# Altium schematic sheet PD Controller Source.SchDoc
size 297 x 209 mm; CompanyName: Sainsbury Wellcome Centre; Organization: FabLab; Address1: Sainsbury Wellcome Centre; Address2: 25 Howland Street; Address3: London; Address4: W1T 4JG; DocumentNumber: 9; SheetNumber: 9; SheetTotal: 14; swcgroup: FabLab; Org: Sainsbury Wellcome Centre; Add1: 25 Howland Street; Add2: London; Add3: W1T 4JG; WebAddress: www.sainsburywellcome.org; SheetSize: A4; SheetName: PD Controller Source
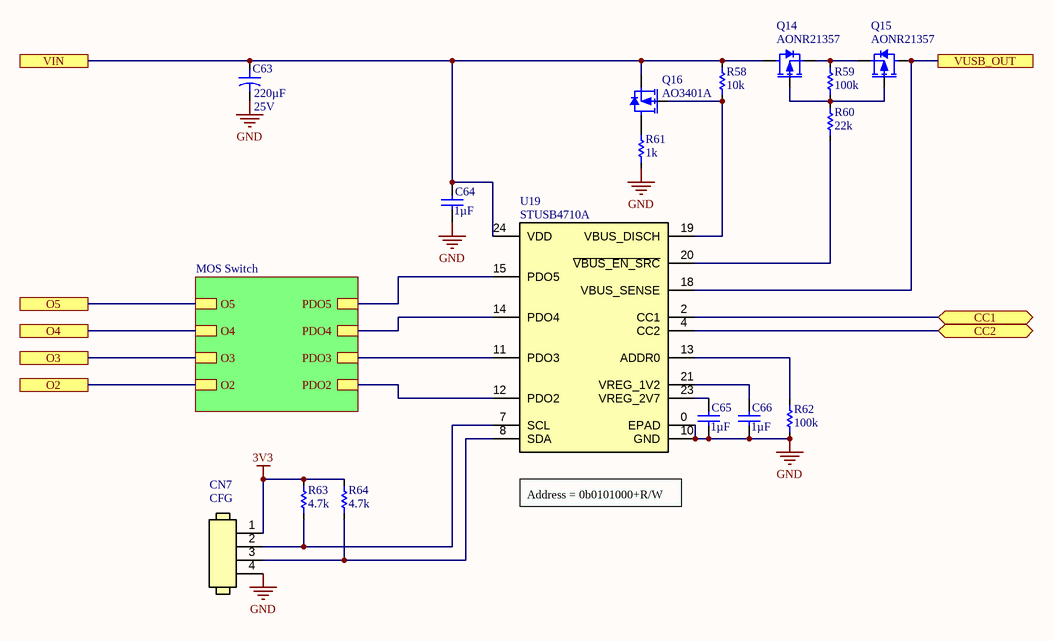
[diagram p0: PD Controller Source.SchDoc]

## Parts
C63  value 220µF  Voltage Rating: 25V  [ECAP_SMD_6.3]  (hidden comment: SC63-220uF-25V)
C64  value 1µF  [CAP_CHIP_0603]  (hidden comment: C0603-1uF-50V)
C65  value 1µF  [CAP_CHIP_0603]  (hidden comment: C0603-1uF-50V)
C66  value 1µF  [CAP_CHIP_0603]  (hidden comment: C0603-1uF-50V)
CN7  CFG  [MOLEX_1.25_4P]
Q14  AONR21357  [DFN-8-MOS]
Q15  AONR21357  [DFN-8-MOS]
Q16  AO3401A  [SOT23]
R58  value 10k  [RES_CHIP_0603]  (hidden comment: R0603-10K)
R59  value 100k  [RES_CHIP_0603]  (hidden comment: R0603-100K)
R60  value 22k  [RES_CHIP_0603]  (hidden comment: R0603-22K)
R61  value 1k  [RES_CHIP_0805]  (hidden comment: R0805-1K)
R62  value 100k  [RES_CHIP_0603]  (hidden comment: R0603-100K)
R63  value 4.7k  [RES_CHIP_0603]  (hidden comment: R0603-4K7)
R64  value 4.7k  [RES_CHIP_0603]  (hidden comment: R0603-4K7)
U19  STUSB4710A  [QFN24]

## Sub-sheets
MOS Switch = MOS Switch.SchDoc: O5, O4, O3, O2, PDO2, PDO3, PDO4, PDO5

## Ports
CC1 (bidir), CC2 (bidir), O2, O3, O4, O5, VIN, VUSB_OUT

## Nets
3V3: CN7.1 R63.2 R64.2
GND: C63.2 C64.2 C65.2 C66.2 CN7.4 R61.1 R62.1 U19.0(EPAD) U19.10(GND)
CC1: U19.2(CC1) ; port CC1
CC2: U19.4(CC2) ; port CC2
O2: port O2, sheet MOS Switch/O2
O3: port O3, sheet MOS Switch/O3
O4: port O4, sheet MOS Switch/O4
O5: port O5, sheet MOS Switch/O5
VIN: C63.1 C64.1 Q14.5(D) Q16.2(S) R58.2 U19.24(VDD) ; port VIN
VUSB_OUT: Q15.5(D) U19.18(VBUS_SENSE) ; port VUSB_OUT
NetC65_1: C65.1 U19.23(VREG_2V7)
NetC66_1: C66.1 U19.21(VREG_1V2)
NetCN7_2: CN7.2 R63.1 U19.7(SCL)
NetCN7_3: CN7.3 R64.1 U19.8(SDA)
NetQ14_1,2,3: Q14.1,2,3(S) Q15.1,2,3(S) R59.2
NetQ14_4: Q14.4(G) Q15.4(G) R59.1 R60.2
NetQ16_1: Q16.1(G) R58.1 U19.19(VBUS_DISCH)
NetQ16_3: Q16.3(D) R61.2
NetR60_1: R60.1 U19.20(~{VBUS_EN_SRC})
NetR62_2: R62.2 U19.13(ADDR0)
NetU19_11: U19.11(PDO3) ; sheet MOS Switch/PDO3
NetU19_12: U19.12(PDO2) ; sheet MOS Switch/PDO2
NetU19_14: U19.14(PDO4) ; sheet MOS Switch/PDO4
NetU19_15: U19.15(PDO5) ; sheet MOS Switch/PDO5

## Notes on the sheet
- Address = 0b0101000+R/W
- FILE
- VARIANT
- DATE
- REVISION
- SHEET
- /
- PROJECT
- SIZE

## Library data of the parts
C63 = CMP-610-0003-4: 25V 220uF ±20% SMD,D6.3xL7.7mm Solid Capacitors; PartNumber: HV1E477M0810PZ; Pick&PlaceFootprint: EC63; ESR (Equivalent Series Resistance): 35mR; Mount: Surface Mount; RoHS: Yes; Capacitor Type: Solid; LCSC Part N.: C5246541; Tolerance: 20%
C64-C66 = CMP-611-0033-11: 0603 Multilayer Ceramic Capacitors MLCC; PartNumber: CL10A105KB8NNNC; Pick&PlaceFootprint: C0603; Voltage Rating: 50V; Dielectric: X5R; Tolerance: 10%; Case/Package: 0603; LCSC Part N.: C15849; RoHS: Yes; Mount: SMD; Capacitor Type: Ceramic
CN7 = CMP-370-0030-7: Conn Shrouded Header (3 Sides) HDR 4 POS 1.25mm Solder ST Top Entry SMD PicoBlade™ T/R; PartNumber: 53398-0471; Current Rating: 1A; Number of Positions: 4; Gender: Male; LCSC Part N.: C17617036; Orientation: Vertical; Number of Rows: 1; Pitch: 1.25mm; Mounting Technology: Surface Mount
Q14 Q15 = CMP-810-0004-1: 30V 30A 7.8mΩ@10V,20A 2.3V@250uA 1 PChannel DFN-8 MOSFETs; Drain-Source Voltage (Vds): -30V; RDS(ON): 8mR; Gate-Source Voltage (Vgs): 25V; Power Dissipation: 30W; Switching Time: 200ns; Drain Current (Id): -34A; Polarity: P Channel; Mount: Surface Mount; Pick&PlaceFootprint: DFN-8; PartNumber: AONR21357; LCSC Part N.: C431196
Q16 = CMP-810-0003-2: 30V 4A 44mΩ@10V,4.3A 1.4W 1.3V@250uA 1 PChannel SOT-23-3L MOSFETs; RDS(ON): 44mR; Gate-Source Voltage (Vgs): 12V; Pick&PlaceFootprint: SOT-23; Drain Current (Id): -4A; Switching Time: 60ns; Drain-Source Voltage (Vds): -30V; Polarity: P Channel; Power Dissipation: 1.4W; LCSC Part N.: C15127; Mount: Surface Mount; PartNumber: AO3401A
R58 = CMP-633-0002-26: 100mW Thick Film Resistors 75V ±100ppm/℃ ±1% 0603 Chip Resistor; PartNumber: 0603WAF1002T5E; Number of Resistors: 1; Pick&PlaceFootprint: R0603; Case/Package: 0603; Voltage Rating: 75V; Power Rating: 100mW; LCSC Part N.: C25804; Tolerance: 1%; Mount: Surface Mount
R59 R62 = CMP-633-0000-28: 100mW Thick Film Resistors 75V ±100ppm/℃ ±1% 0603 Chip Resistor; PartNumber: 0603WAF1003T5E; Number of Resistors: 1; Pick&PlaceFootprint: R0603; LCSC Part N.: C25803; Mount: Surface Mount; Voltage Rating: 75V; Power Rating: 100mW; Case/Package: 0603; Tolerance: 1%
R60 = CMP-633-0099-12: 100mW Thick Film Resistors 75V ±100ppm/℃ ±1% 0603 Chip Resistor; PartNumber: 0603WAF2202T5E; Pick&PlaceFootprint: R0603; Number of Resistors: 1; LCSC Part N.: C31850; Mount: Surface Mount; Case/Package: 0603; Voltage Rating: 75V; Power Rating: 100mW; Tolerance: 1%
R61 = CMP-633-0028-14: 125mW Thick Film Resistors 150V ±100ppm/℃ ±1% 0805 Chip Resistor; PartNumber: 0805W8F1001T5E; Pick&PlaceFootprint: R0805; Number of Resistors: 1; Voltage Rating: 150V; Mount: SMD; Case/Package: 0805; Power Rating: 125mW; Tolerance: 1%; LCSC Part N.: C17513
R63 R64 = CMP-633-0024-26: 100mW Thick Film Resistors 75V ±100ppm/℃ ±1% 0603 Chip Resistor; PartNumber: 0603WAF4701T5E; Pick&PlaceFootprint: R0603; Number of Resistors: 1; Case/Package: 0603; Voltage Rating: 75V; Tolerance: 1%; Power Rating: 100mW; LCSC Part N.: C23162; Mount: Surface Mount
U19 = CMP-970-0030-12: Power Supply Support Circuit, Adjustable, 1 Channel, +0.2,.4..8,1.6,2.6; PartNumber: STUSB4710AQTR; Pick&PlaceFootprint: QFN24; LCSC Part N.: C2655458